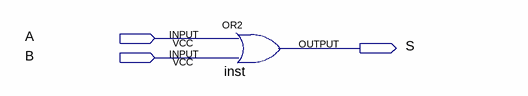
[diagram p0: schematic sheet]
// Quartus schematic misc_6.bdf as structural Verilog: 1 symbols, 3 pins
module misc_6 (
  input  A,
  input  B,
  output S
);

  or inst (S, A, B);
endmodule
